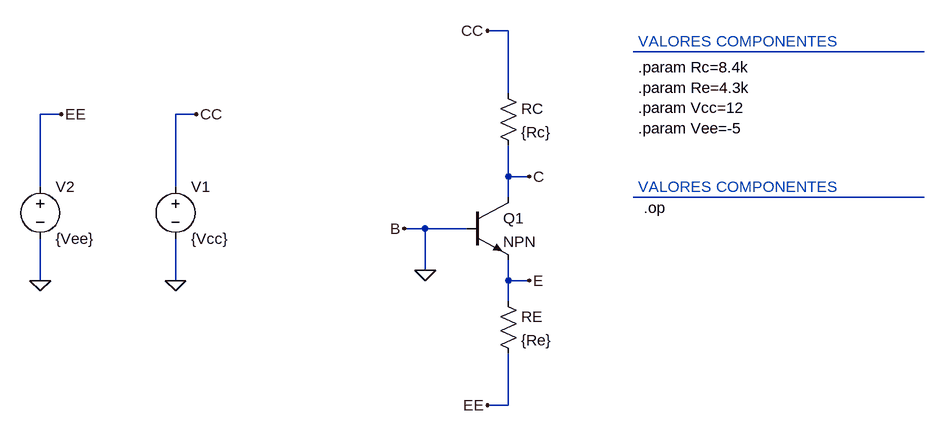
[diagram p0: schematic ejemplo2.asc]
ejemplo2.asc, the LTspice schematic file:
Version 4
SHEET 1 1064 680
WIRE 320 -128 288 -128
WIRE 960 -96 512 -96
WIRE 320 -32 320 -128
WIRE -368 0 -400 0
WIRE -160 0 -192 0
WIRE 320 96 320 48
WIRE 352 96 320 96
WIRE -400 112 -400 0
WIRE -192 112 -192 0
WIRE 320 128 320 96
WIRE 960 128 512 128
WIRE 192 176 160 176
WIRE 256 176 192 176
WIRE 192 240 192 176
WIRE -400 256 -400 192
WIRE -192 256 -192 192
WIRE 320 256 320 224
WIRE 352 256 320 256
WIRE 320 288 320 256
WIRE 320 448 320 368
WIRE 320 448 288 448
FLAG -192 256 0
FLAG 160 176 B
FLAG 352 96 C
FLAG 352 256 E
FLAG -160 0 CC
FLAG 288 -128 CC
FLAG 192 240 0
FLAG -400 256 0
FLAG -368 0 EE
FLAG 288 448 EE
SYMBOL voltage -192 96 R0
WINDOW 123 0 0 Left 0
WINDOW 39 0 0 Left 0
SYMATTR InstName V1
SYMATTR Value {Vcc}
SYMBOL res 304 -48 R0
SYMATTR InstName RC
SYMATTR Value {Rc}
SYMBOL res 304 272 R0
SYMATTR InstName RE
SYMATTR Value {Re}
SYMBOL npn 256 128 R0
SYMATTR InstName Q1
SYMBOL voltage -400 96 R0
WINDOW 123 0 0 Left 0
WINDOW 39 0 0 Left 0
SYMATTR InstName V2
SYMATTR Value {Vee}
TEXT 520 -112 Left 2 ;VALORES COMPONENTES
TEXT 520 -72 Left 2 !.param Rc=8.4k \n.param Re=4.3k \n.param Vcc=12 \n.param Vee=-5
TEXT 520 112 Left 2 ;VALORES COMPONENTES
TEXT 528 144 Left 2 !.op

The netlist it stands for:
* ejemplo2.asc
V1 CC 0 {Vcc}
RC CC C {Rc}
RE E EE {Re}
Q1 C 0 E 0 NPN
V2 EE 0 {Vee}
.model NPN NPN
.model PNP PNP
.lib standard.bjt
* VALORES COMPONENTES
.param Rc=8.4k
.param Re=4.3k
.param Vcc=12
.param Vee=-5
* VALORES COMPONENTES
.op
.backanno
.end